# EAGLE schematic CervusShield_io (EAGLE 6.5.0)
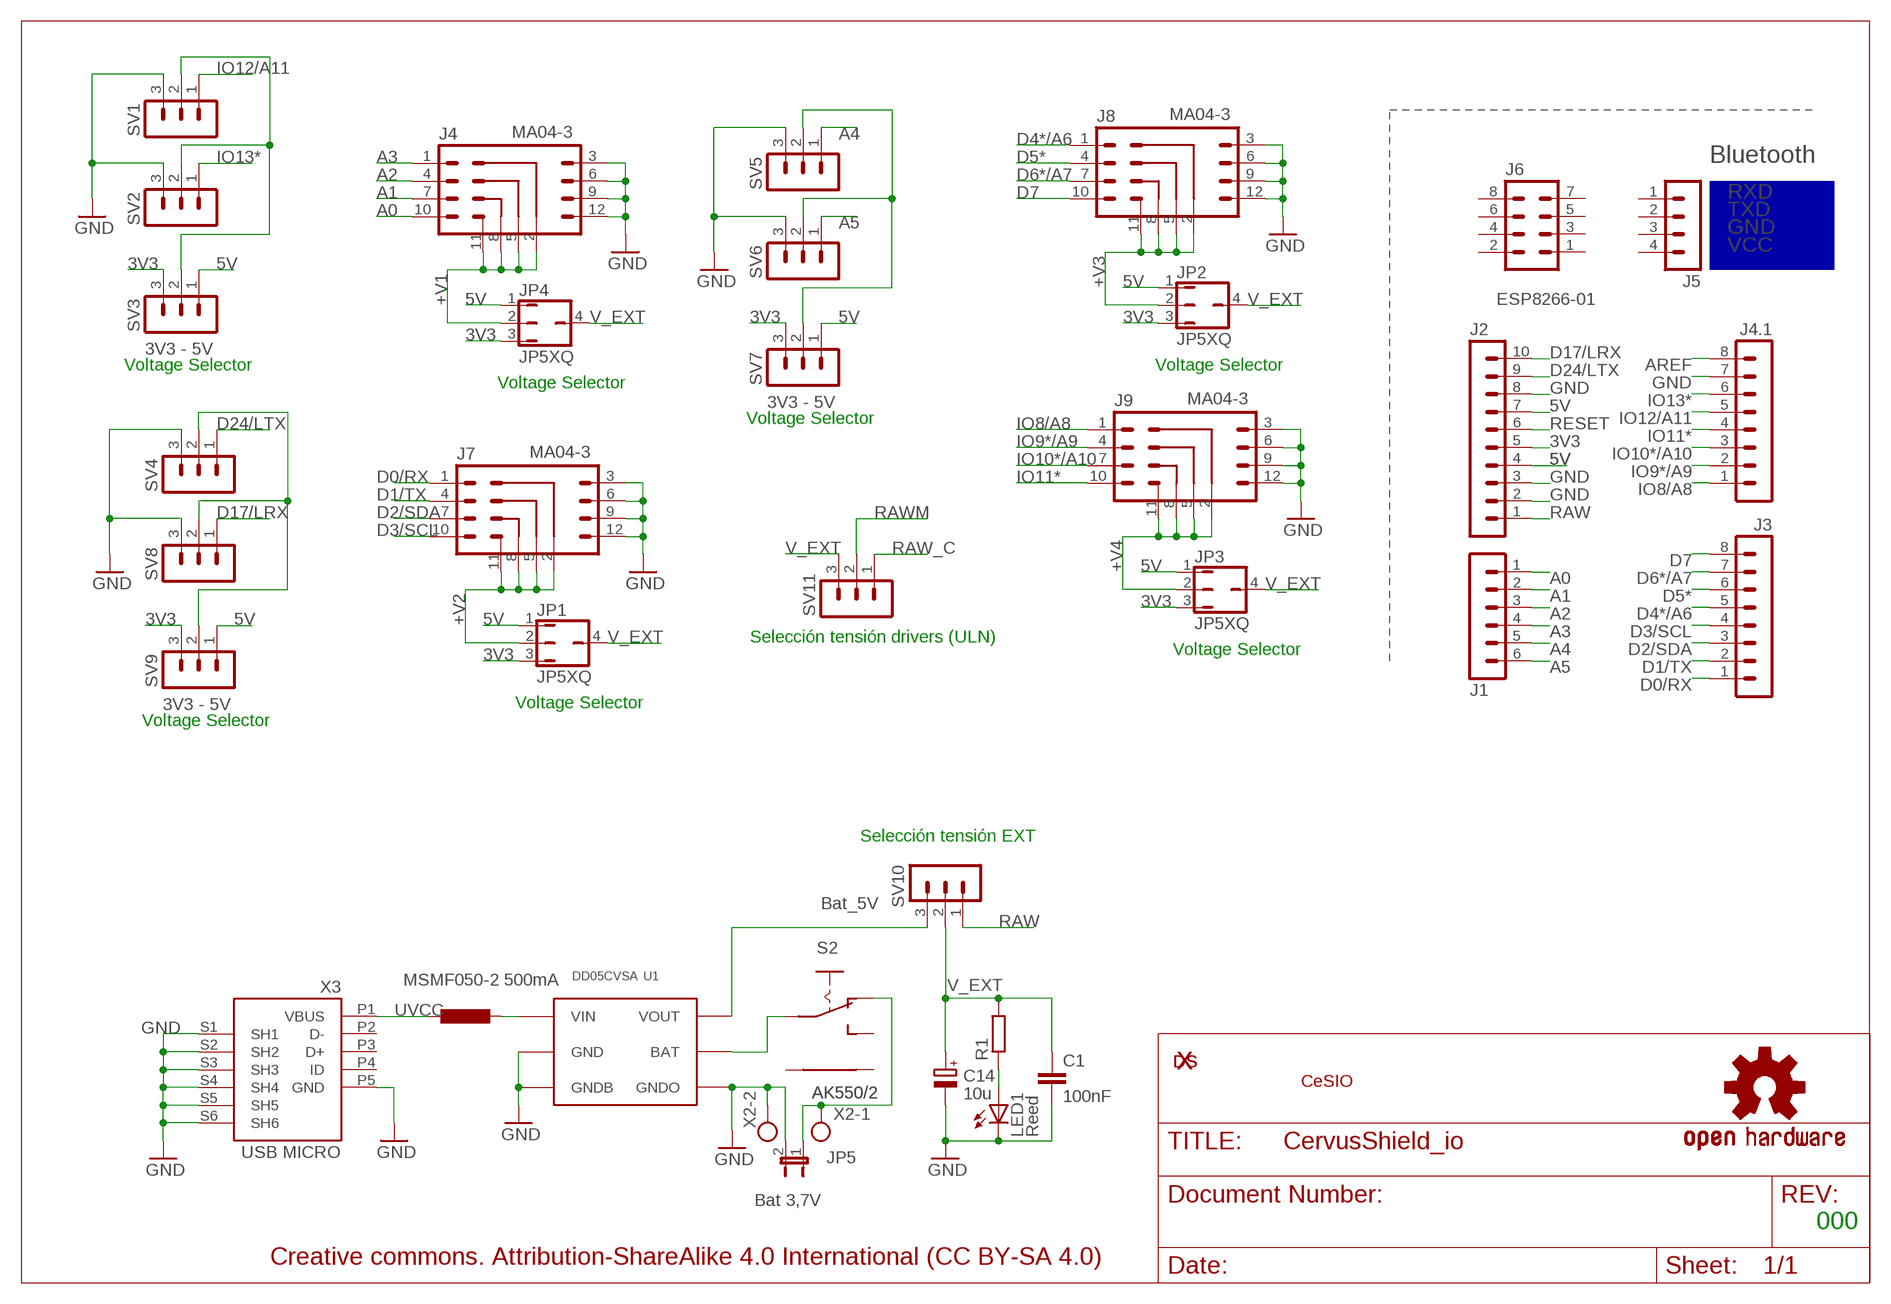
[diagram p0: schematic, sheet 1]

## Parts
C1  100nF  C-EUC0603  [C0603]
C14  10u  CPOL-EUSMCB  [SMC_B]
F1  MSMF050-2 500mA  L-EUL1812  [L1812]
J1  Connector, 2.54 mm, 1x6 Contacts, Receptacle  MA06-1  [MA06-1]
J2  Connector, Vertical 2.54 mm, 1x10 Contacts, Receptacle  MA10-1  [MA10-1]
J3  Connector, Vertical, 2.54 mm, 8 Contacts, Receptacle  MA08-1  [MA08-1]
J4  MA04-3  [MA04-3]
J4.1  Connector, Vertical, 2.54 mm, 8 Contacts, Receptacle  MA08-1  [MA08-1]
J5  Connector, Vertical, 2.54 mm, 1x4 Contacts, Receptacle  MA04-1  [MA04-1]
J6  Connector, Vertical, 2.54 mm, 2x4 (8) Contacts, Receptacle  MA04-2  [MA04-2]
J7  MA04-3  [MA04-3]
J8  MA04-3  [MA04-3]
J9  MA04-3  [MA04-3]
JP1  JP5XQ  [JP5XQ]
JP2  JP5XQ  [JP5XQ]
JP3  JP5XQ  [JP5XQ]
JP4  JP5XQ  [JP5XQ]
JP5  JP1E  [JP1]
LED1  Reed  LEDCHIPLED_0603  [CHIPLED_0603]
LOGO1  OSHW-LOGOS  [OSHW-LOGO-S]
R1  R-EU_R0603  [R0603]
S2  ESCORNA_SK12F14D  [ESCORNA_SK-12D07]
SV1  MA03-1  [MA03-1]
SV2  MA03-1  [MA03-1]
SV3  MA03-1  [MA03-1]
SV4  MA03-1  [MA03-1]
SV5  MA03-1  [MA03-1]
SV6  MA03-1  [MA03-1]
SV7  MA03-1  [MA03-1]
SV8  MA03-1  [MA03-1]
SV9  MA03-1  [MA03-1]
SV10  MA03-1  [MA03-1]
SV11  MA03-1  [MA03-1]
U1  DD05CVSA  [DD05CVSA]
U$1  XDESIG  [XDESIG_CU_2]
U$3  XDESIG  [XDESIG_CU_2]
X2  AK550/2  [AK550/2]
X3  USB MICRO  MYCON2_USB-MINI-B  [CON2_USB_MICRO_B_AT]

## Nets
3V3: J2.5 JP1.3 JP2.3 JP3.3 JP4.3 SV3.3 SV7.3 SV9.3
5V: J2.4 J2.7 JP1.1 JP2.1 JP3.1 JP4.1 SV3.1 SV7.1 SV9.1
+V1: J4.2 J4.5 J4.8 J4.11 JP4.2
+V2: J7.2 J7.5 J7.8 J7.11 JP1.2
+V3: J8.2 J8.5 J8.8 J8.11 JP2.2
+V4: J9.2 J9.5 J9.8 J9.11 JP3.2
A0: J1.1 J4.10
A1: J1.2 J4.7
A2: J1.3 J4.4
A3: J1.4 J4.1
A4: J1.5 SV5.1
A5: J1.6 SV6.1
AREF [aref]: J4.1.8
D0/RX: J3.1 J7.1
D1/TX: J3.2 J7.4
D2/SDA: J3.3 J7.7
D3/SCL: J3.4 J7.10
D4*/A6: J3.5 J8.1
D5*: J3.6 J8.4
D6*/A7: J3.7 J8.7
D7: J3.8 J8.10
D17/LRX: J2.10 SV8.1
D24/LTX: J2.9 SV4.1
GND [power]: C1.2 C14.- J2.2 J2.3 J2.8 J4.1.7 J4.3 J4.6 J4.9 J4.12 J7.3 J7.6 J7.9 J7.12 J8.3 J8.6 J8.9 J8.12 J9.3 J9.6 J9.9 J9.12 JP5.2 LED1.C SV1.3 SV2.3 SV4.3 SV5.3 SV6.3 SV8.3 U1.P$2(GND) U1.P$4(GNDB) U1.P$5(GNDO) X2.2 X3.P5(GND) X3.S1(SH1) X3.S2(SH2) X3.S3(SH3) X3.S4(SH4) X3.S5(SH5) X3.S6(SH6)
IO8/A8: J4.1.1 J9.1
IO9*/A9: J4.1.2 J9.4
IO10*/A10: J4.1.3 J9.7
IO11*: J4.1.4 J9.10
IO12/A11: J4.1.5 SV1.1
IO13*: J4.1.6 SV2.1
N$1: SV1.2 SV2.2 SV3.2
N$2: S2.P$1(P) U1.P$3(BAT)
N$3: SV5.2 SV6.2 SV7.2
N$4: F1.1 U1.P$1(VIN)
N$5: SV10.3 U1.P$6(VOUT)
N$6: LED1.A R1.1
N$7: SV4.2 SV8.2 SV9.2
N$8: JP5.1 S2.P$2(O) X2.1
RAW: J2.1 SV10.1
RAW_C: SV11.1
RAWM: SV11.2
RESET: J2.6
UVCC: F1.2 X3.P1(VBUS)
V_EXT: C1.1 C14.+ JP1.4 JP2.4 JP3.4 JP4.4 R1.2 SV10.2 SV11.3
Unconnected: J5.1 J5.2 J5.3 J5.4 J6.1 J6.2 J6.3 J6.4 J6.5 J6.6 J6.7 J6.8 S2.P$3(S) S2.P$4 S2.P$5 X3.P2(D-) X3.P3(D+) X3.P4(ID)

## Notes on the sheet
- Bluetooth
- RXD
- TXD
- GND
- VCC
- ESP8266-01
- 3V3 - 5V
- Voltage Selector | Voltage Selector
- Voltage Selector
- 3V3 - 5V
- Voltage Selector
- Selección tensión drivers (ULN) | Voltage Selector
- 3V3 - 5V | Voltage Selector
- Voltage Selector
- Selección tensión EXT
- Bat_5V
- CeSIO
- Bat 3,7V
- 000
- Creative commons. Attribution-ShareAlike 4.0 International (CC BY-SA 4.0)

## Library data of the parts
C1 = rcl:C-EU: CAPACITOR, European symbol
C14 = rcl:CPOL-EU: POLARIZED CAPACITOR, European symbol
F1 = rcl:L-EU: INDUCTOR, European symbol
J1 = con-lstb:MA06-1: PIN HEADER; OC_FARNELL: unknown; OC_NEWARK: unknown
J2 = con-lstb:MA10-1: PIN HEADER; OC_FARNELL: unknown; OC_NEWARK: unknown
J3 J4.1 = con-lstb:MA08-1: PIN HEADER; OC_FARNELL: unknown; OC_NEWARK: unknown
J4 J7-J9 = con-lstb:MA04-3
J5 = con-lstb:MA04-1: PIN HEADER; OC_FARNELL: unknown; OC_NEWARK: unknown
J6 = con-lstb:MA04-2: PIN HEADER; OC_FARNELL: unknown; OC_NEWARK: unknown
JP1-JP4 = jumper:JP5XQ
JP5 = jumper:JP1E: JUMPER
LED1 = led:LED: LED OSRAM: - CHIPLED LG R971, LG N971, LY N971, LG Q971, LY Q971, LO R971, LY R971 LH N974, LH R974 LS Q976, LO Q976, LY Q976 LO Q996 - Hyper CHIPLED LW Q18S LB Q993, LB Q99A, LB R99A - SideLED LS A670, LO A670, LY A670, LG A670, LP A670 LB A673, LV A673, LT A673, LW A673 LH A674 LY A675 LS A676, LA A676, LO A676, LY A676, LW A676 LS A679, LY A679, LG A679 - Hyper Micro SIDELED® LS Y876, LA Y876, LO Y876, LY Y876 LT Y87S - SmartLED LW L88C, LW L88S LB L89C, LB L89S, LG L890 LS L89K, LO L89K, LY L89K LS L896, LA L896, LO L896, LY L896 - TOPLED LS T670, LO T670, LY T670, LG T670, LP T670 LSG T670, LSP T670, LSY T670, LOP T670, LYG T670 LG T671, LOG T671, LSG T671 LB T673, LV T673, LT T673, LW T673 LH T674 LS T676, LA T676, LO T676, LY T676, LB T676, LH T676, LSB T676, LW T676 LB T67C, LV T67C, LT T67C, LS T67K, LO T67K, LY T67K, LW E67C LS E67B, LA E67B, LO E67B, LY E67B, LB E67C, LV E67C, LT E67C LW T67C LS T679, LY T679, LG T679 LS T770, LO T770, LY T770, LG T770, LP T770 LB T773, LV T773, LT T773, LW T773 LH T774 LS E675, LA E675, LY E675, LS T675 LS T776, LA T776, LO T776, LY T776, LB T776 LHGB T686 LT T68C, LB T68C - Hyper Mini TOPLED® LB M676 - Mini TOPLED Santana® LG M470 LS M47K, LO M47K, LY M47K Source: http://www.osram.convergy.de LUXEON: - LUMILED® LXK2-PW12-R00, LXK2-PW12-S00, LXK2-PW14-U00, LXK2-PW14-V00 LXK2-PM12-R00, LXK2-PM12-S00, LXK2-PM14-U00 LXK2-PE12-Q00, LXK2-PE12-R00, LXK2-PE12-S00, LXK2-PE14-T00, LXK2-PE14-U00 LXK2-PB12-K00, LXK2-PB12-L00, LXK2-PB12-M00, LXK2-PB14-N00, LXK2-PB14-P00, LXK2-PB14-Q00 LXK2-PR12-L00, LXK2-PR12-M00, LXK2-PR14-Q00, LXK2-PR14-R00 LXK2-PD12-Q00, LXK2-PD12-R00, LXK2-PD12-S00 LXK2-PH12-R00, LXK2-PH12-S00 LXK2-PL12-P00, LXK2-PL12-Q00, LXK2-PL12-R00 Source: www.luxeon.com KINGBRIGHT: KA-3528ASYC Source: www.kingbright.com
LOGO1 = SparkFun-Aesthetics:OSHW-LOGO: Open Source Hardware Logo This logo indicates the piece of hardware it is found on incorporates a OSHW license and/or adheres to the definition of open source hardware found here: http://freedomdefined.org/OSHW
R1 = rcl:R-EU_: RESISTOR, European symbol
S2 = Escorna_CPU_2_01:ESCORNA_SK12F14
SV1-SV11 = con-lstb:MA03-1: PIN HEADER; OC_FARNELL: unknown; OC_NEWARK: unknown
U1 = escorna_LBREscorna_CPU_2_10:DD05CVSA
U$1 U$3 = xdesig:XDESIG
X2 = con-ptr500:AK550/2: CONNECTOR; OC_FARNELL: unknown; OC_NEWARK: unknown
X3 = SmartPrj:MYCON2_USB-MINI-B

## Net classes
0 default: width 0.254 mm, drill 0.61 mm, clearance 0.254 mm
1 power: width 0.254 mm, drill 0.61 mm, clearance 0.254 mm
2 gnd: width 0.254 mm, drill 0.61 mm, clearance 0.254 mm
3 usbvcc: width 0.254 mm, drill 0.61 mm, clearance 0.254 mm
4 aref: width 0.254 mm, drill 0.61 mm, clearance 0.254 mm